# Altium schematic sheet FDS6675BZ1_FDS6675BZ.schdoc
size 124 x 99 mm
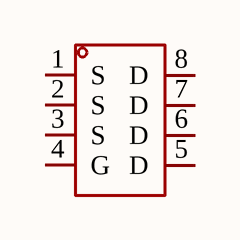
[diagram p0: FDS6675BZ1_FDS6675BZ.schdoc]

## Parts
Q?  FDS6675BZ  [SO-8_L4.9-W3.9-P1.27-LS5.9-BL]  (value not drawn)

## Nets

Not connected (* = marked no-connect by the designer): Q? 1(S) 2(S) 3(S) 4(G) 5(D) 6(D) 7(D) 8(D)

## Library data of the parts
Q? = FDS6675BZ: Manufacturer: onsemi(安森美); Add into BOM: yes; Number: 1 P-Channel; Drain to Source Voltage: 30V; Current - Continuous Drain(Id): 11A; RDS(on): 21.8mΩ@4.5V,9A; Pd - Power Dissipation: 2.5W; Type: P-Channel; Symbol: FDS6675BZ; Device: FDS6675BZ; LCSC Part Name: 1个P沟道 耐压:30V 电流:11A; Supplier Part: C188503; Manufacturer Part: FDS6675BZ; Supplier Footprint: SO-8; JLCPCB Part Class: Extended Part; Datasheet: https://item.szlcsc.com/datasheet/FDS6675BZ/199910.html; Supplier: LCSC; Convert to PCB: yes; Gate Threshold Voltage (Vgs(th)): -; Gate Charge(Qg): -; Input Capacitance(Ciss): -; Reverse Transfer Capacitance (Crss@Vds): -; Operating Temperature: -55℃~+150℃; Output Capacitance(Coss): -